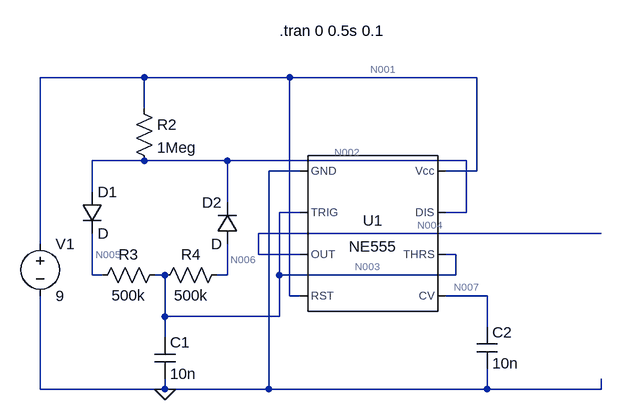
[diagram p0: schematic NE555pwmGenerator.asc]
NE555pwmGenerator.asc, the LTspice schematic file:
Version 4
SHEET 1 980 680
WIRE 208 112 48 112
WIRE 432 112 208 112
WIRE 720 112 432 112
WIRE 208 160 208 112
WIRE 208 240 128 240
WIRE 336 240 208 240
WIRE 704 240 336 240
WIRE 448 256 400 256
WIRE 720 256 720 112
WIRE 720 256 672 256
WIRE 128 288 128 240
WIRE 336 304 336 240
WIRE 448 320 416 320
WIRE 704 320 704 240
WIRE 704 320 672 320
WIRE 912 352 384 352
WIRE 48 368 48 112
WIRE 384 384 384 352
WIRE 448 384 384 384
WIRE 688 384 672 384
WIRE 128 416 128 352
WIRE 144 416 128 416
WIRE 240 416 224 416
WIRE 336 416 336 368
WIRE 336 416 320 416
WIRE 416 416 416 320
WIRE 688 416 688 384
WIRE 688 416 416 416
WIRE 432 448 432 112
WIRE 448 448 432 448
WIRE 736 448 672 448
WIRE 240 480 240 416
WIRE 416 480 416 416
WIRE 416 480 240 480
WIRE 736 496 736 448
WIRE 240 512 240 480
WIRE 48 592 48 448
WIRE 240 592 240 576
WIRE 240 592 48 592
WIRE 400 592 400 256
WIRE 400 592 240 592
WIRE 736 592 736 560
WIRE 736 592 400 592
WIRE 912 592 912 576
WIRE 912 592 736 592
FLAG 240 592 0
SYMBOL Voltage 48 352 R0
SYMATTR InstName V1
SYMATTR Value 9
SYMBOL Misc/NE555 560 352 R0
SYMATTR InstName U1
SYMBOL Res 192 144 R0
SYMATTR InstName R2
SYMATTR Value 1Meg
SYMBOL Diode 112 288 R0
SYMATTR InstName D1
SYMBOL Res 128 432 R270
WINDOW 0 32 56 VTop 2
WINDOW 3 0 56 VBottom 2
SYMATTR InstName R3
SYMATTR Value 500k
SYMBOL Res 224 432 R270
WINDOW 0 32 56 VTop 2
WINDOW 3 0 56 VBottom 2
SYMATTR InstName R4
SYMATTR Value 500k
SYMBOL Cap 224 512 R0
SYMATTR InstName C1
SYMATTR Value 10n
SYMBOL Cap 720 496 R0
SYMATTR InstName C2
SYMATTR Value 10n
SYMBOL Diode 352 368 R180
WINDOW 0 24 64 Left 2
WINDOW 3 24 0 Left 2
SYMATTR InstName D2
TEXT 416 40 Left 2 !.tran 0 0.5s 0.1

The netlist it stands for:
* NE555pwmGenerator.asc
V1 N001 0 9
XU1 0 N003 N004 N001 N007 N003 N002 N001 NE555  ; pins GND TRIG OUT RST CV THRS DIS Vcc
R2 N001 N002 1Meg
D1 N002 N005 D
R3 N005 N003 500k
R4 N003 N006 500k
C1 N003 0 10n
C2 N007 0 10n
D2 N006 N002 D
.model D D
.lib standard.dio
.tran 0 0.5s 0.1
.lib NE555.sub
.backanno
.end

* Results of the author's LTspice run, read from the files saved beside the schematic
* Operating Point, zero values left out:
*   V(n001) = 9 V
*   V(n003) = 8.591 V
*   V(n007) = 6 V
*   V(n002) = 8.971 V
*   V(n004) = 9 V
*   V(n005) = 8.6 V
*   V(n006) = 8.591 V
*   I(D1) = 17.18 nA
*   I(R2) = 29.15 nA
*   I(R3) = 17.18 nA
*   I(V1) = -2.908 mA
*   Ix(u1:1) = -2.908 mA
*   Ix(u1:2) = 8.591 nA
*   Ix(u1:4) = 49.33 µA
*   Ix(u1:6) = 8.591 nA
*   Ix(u1:7) = 11.97 nA
*   Ix(u1:8) = 2.859 mA
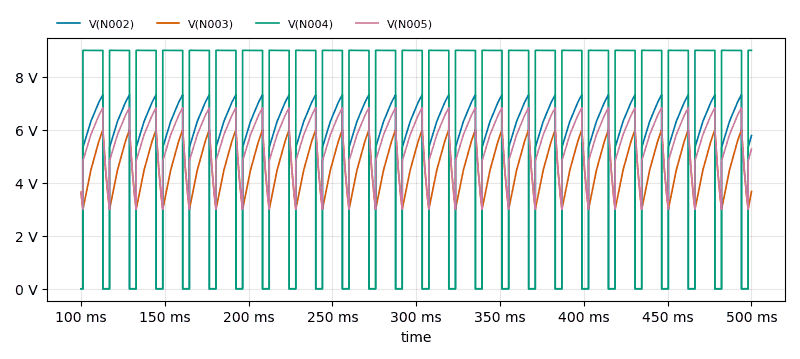
[diagram p1: Transient Analysis of NE555pwmGenerator.asc, plotted from the saved traces]
* Transient Analysis, 1 run:
*   V(N002): min 83.77 µV, max 7.324 V, average 4.822 V, rms 5.6 V, last 5.784 V
*   V(N003): min 2.999 V, max 6.001 V, average 4.574 V, rms 4.683 V, last 3.673 V
*   V(N004): min 54 µV, max 9 V, average 6.742 V, rms 7.79 V, last 9 V
*   V(N005): min 2.999 V, max 6.834 V, average 5.532 V, rms 5.627 V, last 5.278 V